# EAGLE design slider (EAGLE 9.2.2)
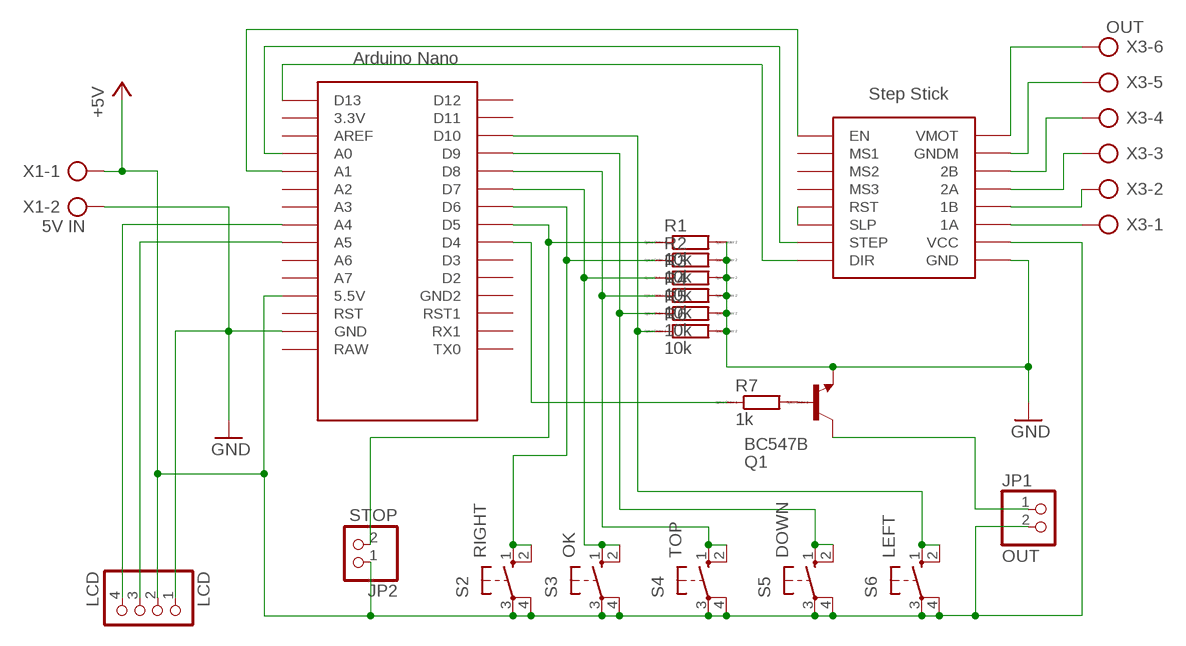
[diagram p0: schematic, sheet 1]

## Parts
JP1  OUT  PINHD-1X2  [1X02]
JP2  STOP  PINHD-1X2  [1X02]
LCD  LCD  PINHD-1X4  [1X04]
Q1  BC547B  [TO92]
R1  10k  R0207/10  [0207/10]
R2  10k  R0207/10  [0207/10]
R3  10k  R0207/10  [0207/10]
R4  10k  R0207/10  [0207/10]
R5  10k  R0207/10  [0207/10]
R6  10k  R0207/10  [0207/10]
R7  1k  R0207/10  [0207/10]
S2  RIGHT  10-XX  [B3F-10XX]
S3  OK  10-XX  [B3F-10XX]
S4  TOP  10-XX  [B3F-10XX]
S5  DOWN  10-XX  [B3F-10XX]
S6  LEFT  10-XX  [B3F-10XX]
U$1  NANO  [NANO]
U$2  STEP-STICK  [STEP-STICK]
X1  5V IN  AK500/2  [AK500/2]
X3  OUT  AK500/6  [AK500/6]

## Nets
+5V: JP1.2 JP2.1 LCD.2 S2.3(P) S2.4(P1) S3.3(P) S3.4(P1) S4.3(P) S4.4(P1) S5.3(P) S5.4(P1) S6.3(P) S6.4(P1) U$1.5V(5.5V) U$2.VCC X1.1
GND: LCD.1 Q1.1(E) R1.2 R2.2 R3.2 R4.2 R5.2 R6.2 U$1.GND U$2.GND X1.2
N$1: U$2.1A X3.1
N$2: U$2.1B X3.2
N$3: U$2.2A X3.3
N$4: U$2.2B X3.4
N$5: U$2.GNDM X3.5
N$6: U$2.VMOT X3.6
N$7: U$1.A0 U$2.SPT(STEP)
N$8: LCD.4 U$1.A4
N$9: LCD.3 U$1.A5
N$10: U$1.D13 U$2.DIR
N$11: JP2.2 R1.1 U$1.D5
N$12: R2.1 S2.1(S) S2.2(S1) U$1.D6
N$13: R3.1 S3.1(S) S3.2(S1) U$1.D7
N$14: R4.1 S4.1(S) S4.2(S1) U$1.D8
N$15: R5.1 S5.1(S) S5.2(S1) U$1.D9
N$16: R6.1 S6.1(S) S6.2(S1) U$1.D10
N$17: U$2.RST U$2.SLP
N$18: R7.1 U$1.D4
N$19: Q1.2(B) R7.2
N$20: U$1.A1 U$2.EN
N$21: JP1.1 Q1.3(C)
Unconnected: U$1.3.3V U$1.A2 U$1.A3 U$1.A6 U$1.A7 U$1.AREF U$1.D2 U$1.D3 U$1.D11 U$1.D12 U$1.GND1(GND2) U$1.ICSP1 U$1.ICSP2 U$1.ICSP3 U$1.ICSP4 U$1.ICSP5 U$1.ICSP6 U$1.RAW U$1.RST U$1.RST1 U$1.RX1 U$1.TX0 U$2.MS1 U$2.MS2 U$2.MS3

## Library data of the parts
JP1 JP2 = pinhead:PINHD-1X2: PIN HEADER
LCD = pinhead:PINHD-1X4: PIN HEADER
Q1 = transistor-npn:BC547*: NPN Transistor
R1-R7 = eagle-ltspice:R: RESISTOR, European symbol; SPICEMODEL: NONE; SPICEPREFIX: R
S2-S6 = switch-omron:10-XX: OMRON SWITCH; MPN: B3F-1000; OC_FARNELL: 176432; OC_NEWARK: 36M3542
U$1 = Arduino-clone:NANO: Arduino Nano
U$2 = Arduino-clone:STEP-STICK
X1 = con-ptr500:AK500/2: CONNECTOR; OC_FARNELL: unknown; OC_NEWARK: unknown
X3 = con-ptr500:AK500/6: CONNECTOR; OC_FARNELL: unknown; OC_NEWARK: unknown

## Board
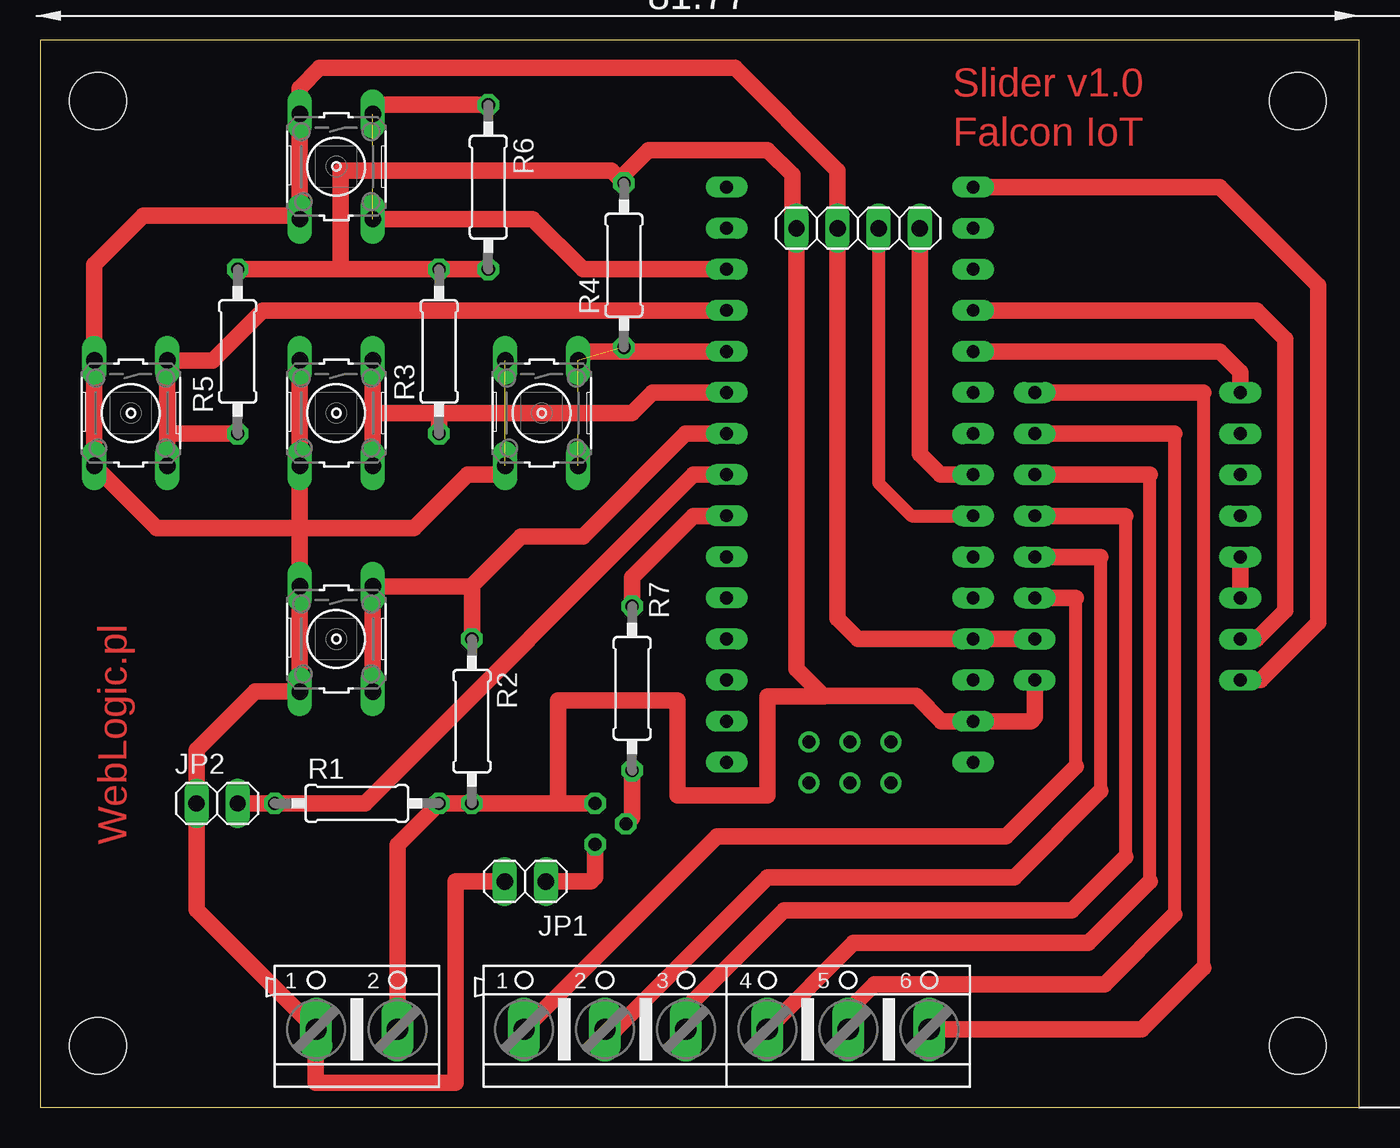
[diagram p1: board, top side]
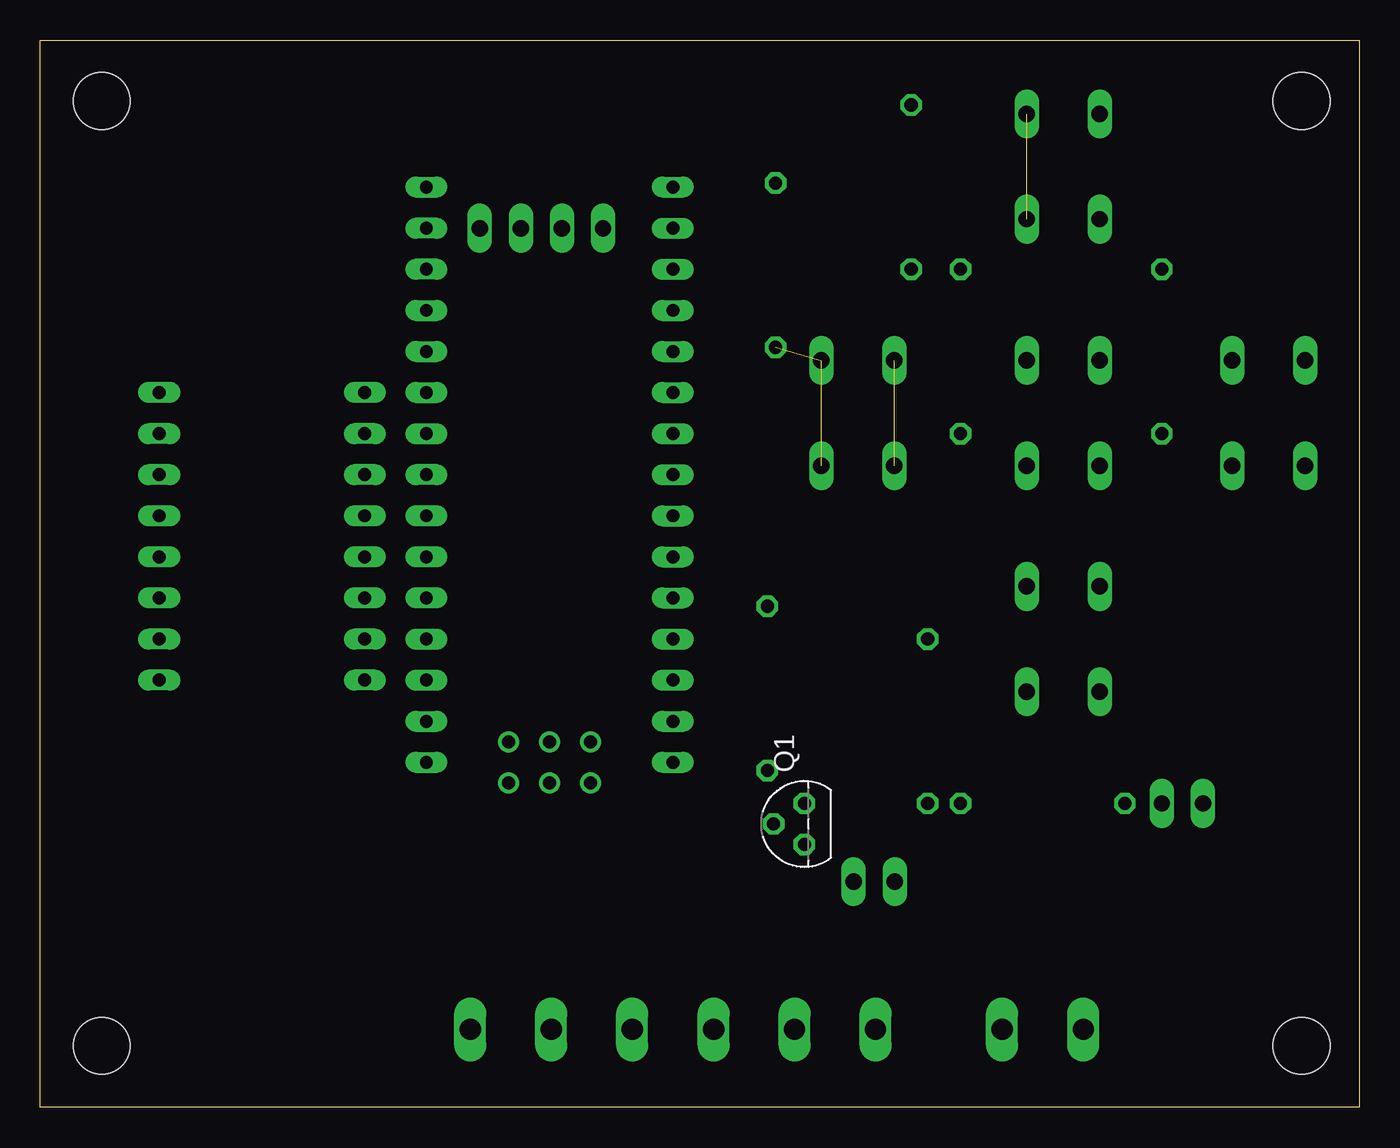
[diagram p2: board, bottom side, seen from below]

Size 81.51 x 65.96 mm. Coordinates in mm from the lower left corner, seen from the top.
Outline: 0,0 81.51,0 81.51,65.96 0,65.96 0,0
Copper layers (1*16): Top 0.035mm / dielectric 1.5mm / Bottom 0.035mm
Design rules "default": minimum track width 6mil, minimum drill 0.35mm, track to track 6mil, track to pad 6mil, pad to pad 6mil, via to via 6mil, smd to smd 6mil, copper to edge 40mil, drill to drill 6mil, minimum pad ring 10mil, minimum via ring 8mil, stop-mask expansion 4mil, vias tented up to drill 0mil, thermal gap 10mil
Holes 3.5 mm at 3.56,62.23 77.72,62.23 3.56,3.81 77.72,3.81

### Footprints (pad centres in the part's own frame; a part is rotated, then mirrored left to right if it is on the bottom)
1X02 = drill 1.016 long: 1 -1.27,0; 2 1.27,0
1X04 = drill 1.016 long: 1 -3.81,0; 2 -1.27,0; 3 1.27,0; 4 3.81,0
TO92 = drill 0.813 octagon: 1 1.27,0; 2 0,1.905; 3 -1.27,0
0207/10 = drill 0.813 octagon: 1 -5.08,0; 2 5.08,0
B3F-10XX = drill 1.016 long: 1 -3.251,2.261; 2 3.251,2.261; 3 -3.251,-2.261; 4 3.251,-2.261
NANO = drill 0.8 long: 3.3V -10.16,24.13; 5V -10.16,-1.27; A0 -10.16,19.05; A1 -10.16,16.51; A2 -10.16,13.97; A3 -10.16,11.43; A4 -10.16,8.89; A5 -10.16,6.35; A6 -10.16,3.81; A7 -10.16,1.27; AREF -10.16,21.59; D2 5.08,1.27; D3 5.08,3.81; D4 5.08,6.35; D5 5.08,8.89; D6 5.08,11.43; D7 5.08,13.97; D8 5.08,16.51; D9 5.08,19.05; D10 5.08,21.59; D11 5.08,24.13; D12 5.08,26.67; D13 -10.16,26.67; GND -10.16,-6.35; GND1 5.08,-1.27; RAW -10.16,-8.89; RST -10.16,-3.81; RST1 5.08,-3.81; RX1 5.08,-6.35; TX0 5.08,-8.89 | drill 0.8: ICSP1 -5.08,-10.16; ICSP2 -5.08,-7.62; ICSP3 -2.54,-10.16; ICSP4 -2.54,-7.62; ICSP5 0,-10.16; ICSP6 0,-7.62
STEP-STICK = drill 0.8 long: 1A -8.89,-7.62; 1B -8.89,-5.08; 2A -8.89,-2.54; 2B -8.89,0; DIR 3.81,-12.7; EN 3.81,5.08; GND -8.89,-12.7; GNDM -8.89,2.54; MS1 3.81,2.54; MS2 3.81,0; MS3 3.81,-2.54; RST 3.81,-5.08; SLP 3.81,-7.62; SPT 3.81,-10.16; VCC -8.89,-10.16; VMOT -8.89,5.08
AK500/2 = drill 1.321 long: 1 -2.515,0; 2 2.515,0
AK500/6 = drill 1.321 long: 1 -12.522,0; 2 -7.518,0; 3 -2.515,0; 4 2.515,0; 5 7.518,0; 6 12.522,0

### Placement (x,y rotation side)
JP1  29.97,13.97 180 top
JP2  10.92,18.8 0 top
LCD  50.55,54.36 0 top
Q1  34.29,17.53 90 bottom
R1  19.56,18.8 0 top
R2  26.67,23.88 270 top
R3  24.64,46.74 90 top
R4  36.07,52.07 90 top
R5  12.19,46.74 90 top
R6  27.69,56.9 270 top
R7  36.58,25.91 270 top
S2  18.29,28.96 270 top
S3  18.29,42.93 270 top
S4  30.99,42.93 270 top
S5  5.59,42.93 270 top
S6  18.29,58.17 270 top
U$1  47.5,30.23 0 bottom
U$2  70.36,39.12 0 top
X1  19.56,4.83 0 top
X3  42.42,4.83 0 top

### Tracks (layer width: path | path; a pad name or v marks a point on that pad's centre or on a via)
+5V  (1 unrouted)
  Top 1.016: S5.3 3.33,52.09 6.35,55.12 16.03,55.12 S6.4 S6.3 16.03,63.02 17.27,64.26 42.93,64.26 49.28,57.91 LCD.2 49.28,30.23 50.55,28.96 U$1.5V U$2.VCC | S4.4 28.17,39.12 26.42,39.12 23.11,35.81 16.03,35.81 | 16.03,35.81 S3.4 S3.3 | 15.87,25.7 S2.4 | 16.03,35.81 7.19,35.81 S5.4 S5.3 | JP1.2 25.65,13.97 25.65,1.52 17.02,1.52 17.02,4.8 X1.1 9.65,12.22 JP2.1 9.65,22.1 13.26,25.7 S2.4 | S2.4 15.95,25.78 | 3.28,46.23 S5.3 | 16.03,35.81 S2.3 S2.4
GND
  Top 1.016: 32,18.8 R2.2 R1.2 22.07,16.23 X1.2 | 32,18.8 Q1.1 | 18.54,51.82 R3.2 R6.2 | 18.54,51.82 R5.2 | 18.54,51.82 18.54,57.91 35.31,57.91 R4.2 36.07,57.66 37.59,59.18 44.96,59.18 46.48,57.66 46.48,54.61 LCD.1 46.74,27.1 48.43,25.4 | 32,18.8 32,25.15 39.37,25.15 39.37,19.3 44.96,19.3 44.96,25.4 48.43,25.4 | 48.43,25.4 48.48,25.44 54.14,25.44 55.71,23.88 U$1.GND 61.21,23.88 61.47,24.13 U$2.GND
N$1
  Top 0.813: 64.01,21.08 64.01,31.5
  Top 1.016: X3.1 41.83,16.76 59.69,16.76 64.01,21.08 | 64.01,31.5 U$2.1A
N$2
  Top 0.813: 65.53,34.04 65.53,19.56
  Top 1.016: U$2.1B 65.53,34.04 | X3.2 35.56,4.83 44.96,14.22 60.2,14.22 65.53,19.56
N$3
  Top 0.813: 67.06,36.58 67.06,15.49
  Top 1.016: U$2.2A 67.06,36.58 | X3.3 39.9,6.12 45.97,12.19 63.75,12.19 67.06,15.49
N$4
  Top 0.813: 68.58,13.97 68.58,39.12
  Top 1.016: X3.4 50.27,10.16 64.77,10.16 68.58,13.97 | 68.58,39.12 U$2.2B
N$5
  Top 0.813: 70.1,41.66 70.1,11.94
  Top 1.016: U$2.GNDM 70.1,41.66 | X3.5 49.94,5.99 51.56,7.62 65.79,7.62 70.1,11.94
N$6
  Top 0.813: 71.88,44.2 71.88,8.64
  Top 1.016: U$2.VMOT 71.88,44.2 | X3.6 68.07,4.83 71.88,8.64
N$7
  Top 1.016: U$2.SPT 75.18,28.96 76.96,30.73 76.96,47.5 75.18,49.28 U$1.A0
N$8
  Top 1.016: LCD.4 54.36,40.39 55.63,39.12 U$1.A4
N$9
  Top 0.813: LCD.3 51.82,38.61 53.85,36.58 U$1.A5
N$10
  Top 1.016: U$2.DIR 75.44,26.42 78.99,29.97 78.99,50.8 72.9,56.9 U$1.D13
N$11
  Top 1.016: U$1.D5 40.39,39.12 20.07,18.8 R1.1 JP2.2
N$12
  Top 1.016: 26.67,32.26 26.62,32.21 S2.1 S2.2 | R2.1 26.67,32.26 | 26.67,32.26 29.72,35.31 33.53,35.31 39.88,41.66 U$1.D6
N$13
  Top 1.016: U$1.D7 37.85,44.2 36.58,42.93 24.64,42.93 | R3.1 24.64,42.93 | S3.2 20.55,42.67 | 20.55,42.67 S3.1 | 20.55,42.67 20.8,42.93 24.64,42.93
N$14  (2 unrouted)
  Top 1.016: U$1.D8 33.81,46.74 S4.1
N$15
  Top 1.016: S5.2 7.85,41.66 | 7.85,41.66 S5.1 10.64,46.18 13.74,49.28 U$1.D9 | R5.1 7.85,41.66
N$16  (1 unrouted)
  Top 1.016: U$1.D10 33.53,51.82 30.43,54.91 S6.2 | S6.1 21.11,61.98 R6.1
N$17
  Top 1.016: U$2.RST U$2.SLP
N$18
  Top 1.016: U$1.D4 40.39,36.58 36.58,32.77 R7.1
N$19
  Top 1.016: Q1.2 36.58,17.91 R7.2
N$20
  Top 1.016: U$2.EN 74.17,45.47 72.9,46.74 U$1.A1
N$21
  Top 1.016: Q1.3 34.29,14.22 34.04,13.97 JP1.1

### Text on the board
Top: Slider v1.0 | Falcon IoT | WebLogic.pl